# EAGLE design custom-arduino (EAGLE 9.6.1)
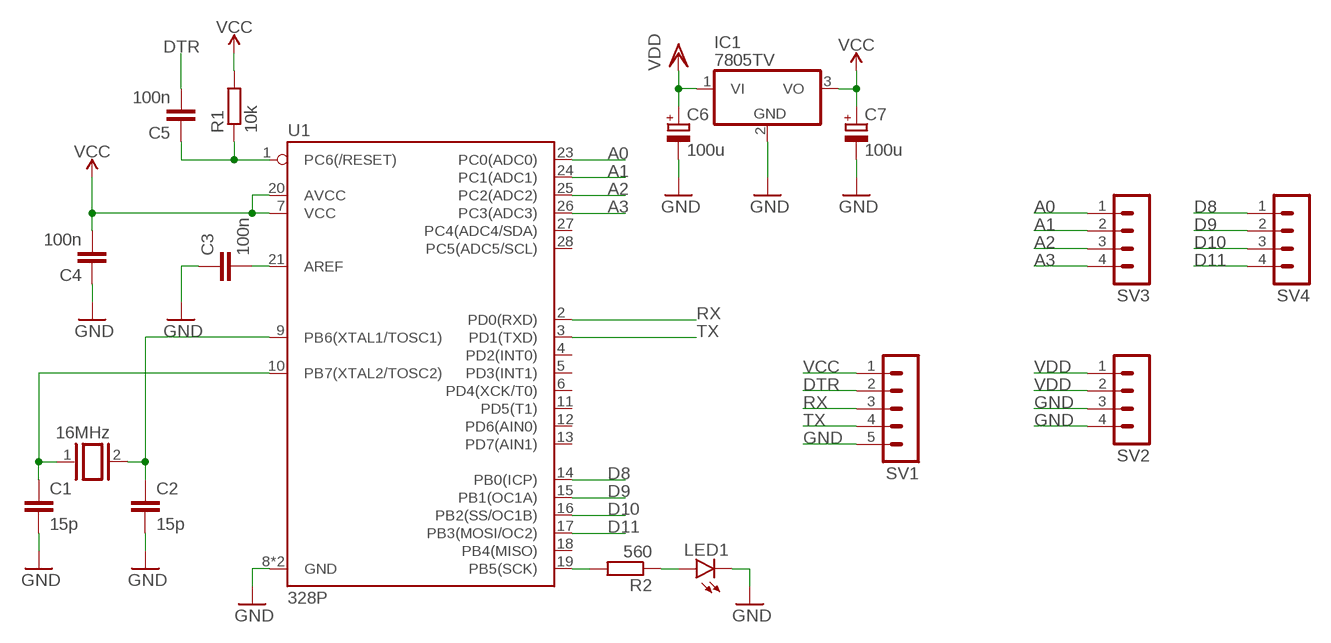
[diagram p0: schematic, sheet 1]

## Parts
C1  15p  C-EU025-024X044  [C025-024X044]
C2  15p  C-EU025-024X044  [C025-024X044]
C3  100n  C-EU025-024X044  [C025-024X044]
C4  100n  C-EU025-024X044  [C025-024X044]
C5  100n  C-EU025-024X044  [C025-024X044]
C6  100u  CPOL-EUE2.5-7  [E2,5-7]
C7  100u  CPOL-EUE2.5-7  [E2,5-7]
IC1  7805TV  [TO220V]
LED1  LED5MM  [LED5MM]
Q1  16MHz  XTAL/S  [QS]
R1  10k  R-EU_0207/10  [0207/10]
R2  560  R-EU_0207/10  [0207/10]
SV1  MA05-1  [MA05-1]
SV2  MA04-1  [MA04-1]
SV3  MA04-1  [MA04-1]
SV4  MA04-1  [MA04-1]
U1  328P  ATMEGA328P_PDIP  [DIP28]

## Nets
A0: SV3.1 U1.23(PC0(ADC0))
A1: SV3.2 U1.24(PC1(ADC1))
A2: SV3.3 U1.25(PC2(ADC2))
A3: SV3.4 U1.26(PC3(ADC3))
D8: SV4.1 U1.14(PB0(ICP))
D9: SV4.2 U1.15(PB1(OC1A))
D10: SV4.3 U1.16(PB2(SS/OC1B))
D11: SV4.4 U1.17(PB3(MOSI/OC2))
DTR: C5.2 SV1.2
GND: C1.2 C2.2 C3.1 C4.1 C6.- C7.- IC1.2(GND) LED1.K(C) SV1.5 SV2.3 SV2.4 U1.8(GND) U1.22(GND)
N$1: C3.2 U1.21(AREF)
N$2: C5.1 R1.1 U1.1(PC6(/RESET))
N$3: R2.2 U1.19(PB5(SCK))
N$4: LED1.A R2.1
N$7: C2.1 Q1.2 U1.9(PB6(XTAL1/TOSC1))
N$8: C1.1 Q1.1 U1.10(PB7(XTAL2/TOSC2))
RX: SV1.3 U1.2(PD0(RXD))
TX: SV1.4 U1.3(PD1(TXD))
VCC: C4.2 C7.+ IC1.3(VO) R1.2 SV1.1 U1.7(VCC) U1.20(AVCC)
VDD: C6.+ IC1.1(VI) SV2.1 SV2.2
Unconnected: U1.4(PD2(INT0)) U1.5(PD3(INT1)) U1.6(PD4(XCK/T0)) U1.11(PD5(T1)) U1.12(PD6(AIN0)) U1.13(PD7(AIN1)) U1.18(PB4(MISO)) U1.27(PC4(ADC4/SDA)) U1.28(PC5(ADC5/SCL))

## Library data of the parts
C1-C5 = rcl:C-EU: CAPACITOR, European symbol; SPICEPREFIX: C
C6 C7 = rcl:CPOL-EU: POLARIZED CAPACITOR, European symbol; SPICEPREFIX: C
IC1 = linear:78*: Positive VOLTAGE REGULATOR Source: http://cache.national.com/ds/LM/LM78L05.pdf http://www.fairchildsemi.com/ds/LM/LM7805.pdf
LED1 = led:LED: LED OSRAM: - CHIPLED LG R971, LG N971, LY N971, LG Q971, LY Q971, LO R971, LY R971 LH N974, LH R974 LS Q976, LO Q976, LY Q976 LO Q996 - Hyper CHIPLED LW Q18S LB Q993, LB Q99A, LB R99A - SideLED LS A670, LO A670, LY A670, LG A670, LP A670 LB A673, LV A673, LT A673, LW A673 LH A674 LY A675 LS A676, LA A676, LO A676, LY A676, LW A676 LS A679, LY A679, LG A679 - Hyper Micro SIDELED® LS Y876, LA Y876, LO Y876, LY Y876 LT Y87S - SmartLED LW L88C, LW L88S LB L89C, LB L89S, LG L890 LS L89K, LO L89K, LY L89K LS L896, LA L896, LO L896, LY L896 - TOPLED LS T670, LO T670, LY T670, LG T670, LP T670 LSG T670, LSP T670, LSY T670, LOP T670, LYG T670 LG T671, LOG T671, LSG T671 LB T673, LV T673, LT T673, LW T673 LH T674 LS T676, LA T676, LO T676, LY T676, LB T676, LH T676, LSB T676, LW T676 LB T67C, LV T67C, LT T67C, LS T67K, LO T67K, LY T67K, LW E67C LS E67B, LA E67B, LO E67B, LY E67B, LB E67C, LV E67C, LT E67C LW T67C LS T679, LY T679, LG T679 LS T770, LO T770, LY T770, LG T770, LP T770 LB T773, LV T773, LT T773, LW T773 LH T774 LS E675, LA E675, LY E675, LS T675 LS T776, LA T776, LO T776, LY T776, LB T776 LHGB T686 LT T68C, LB T68C - Hyper Mini TOPLED® LB M676 - Mini TOPLED Santana® LG M470 LS M47K, LO M47K, LY M47K Source: http://www.osram.convergy.de LUXEON: - LUMILED® LXK2-PW12-R00, LXK2-PW12-S00, LXK2-PW14-U00, LXK2-PW14-V00 LXK2-PM12-R00, LXK2-PM12-S00, LXK2-PM14-U00 LXK2-PE12-Q00, LXK2-PE12-R00, LXK2-PE12-S00, LXK2-PE14-T00, LXK2-PE14-U00 LXK2-PB12-K00, LXK2-PB12-L00, LXK2-PB12-M00, LXK2-PB14-N00, LXK2-PB14-P00, LXK2-PB14-Q00 LXK2-PR12-L00, LXK2-PR12-M00, LXK2-PR14-Q00, LXK2-PR14-R00 LXK2-PD12-Q00, LXK2-PD12-R00, LXK2-PD12-S00 LXK2-PH12-R00, LXK2-PH12-S00 LXK2-PL12-P00, LXK2-PL12-Q00, LXK2-PL12-R00 Source: www.luxeon.com KINGBRIGHT: KA-3528ASYC Source: www.kingbright.com
Q1 = special:XTAL/S: CRYSTAL
R1 R2 = rcl:R-EU_: RESISTOR, European symbol; SPICEPREFIX: R
SV1 = con-lstb:MA05-1: PIN HEADER; OC_FARNELL: unknown; OC_NEWARK: unknown
SV2-SV4 = con-lstb:MA04-1: PIN HEADER; OC_FARNELL: unknown; OC_NEWARK: unknown
U1 = SparkFun-IC-Microcontroller:ATMEGA328P_PDIP: Atmel 328P Through hole ATMEGA328P uC used in the Arduino 32kb flash, 1k EEPROM, 2k SRAM Datasheet <http://www.sparkfun.com/datasheets/Components/SMD/ATMega328.pdf> SparkFun Products Storefront component: AVR 28 Pin 20MHz 32K 6A/D - ATMega328P <https://www.sparkfun.com/products/9061> (COM-09061) SparkFun Simon Says - Through-Hole Soldering Kit <https://www.sparkfun.com/products/10547> (KIT-10547) SparkFun Learn to Solder - Simon Says <https://www.sparkfun.com/products/13708> (KIT-13708) SparkFun BigTime Watch Kit <https://www.sparkfun.com/products/11734> (KIT-11734) SparkFun ClockIt <https://www.sparkfun.com/products/10930> (KIT-10930) SparkFun Serial Enabled LCD Kit <https://www.sparkfun.com/products/10097> (LCD-10097) SparkFun Simon Tilts - Through Hole Soldering Kit <https://www.sparkfun.com/products/12634> (KIT-12634) SparkFun Frequency Counter Kit <https://www.sparkfun.com/products/10140> (KIT-10140) FabFM Radio Kit <https://www.sparkfun.com/products/11043> (KIT-11043) SparkFun Binary Blaster Kit <https://www.sparkfun.com/products/12037> (KIT-12037) SparkFun Metro-Gnome <https://www.sparkfun.com/products/9236> (KIT-09236) ATmega328 with Arduino Optiboot (Uno) <https://www.sparkfun.com/products/10524> (DEV-10524); PROD_ID: IC-09136

## Board
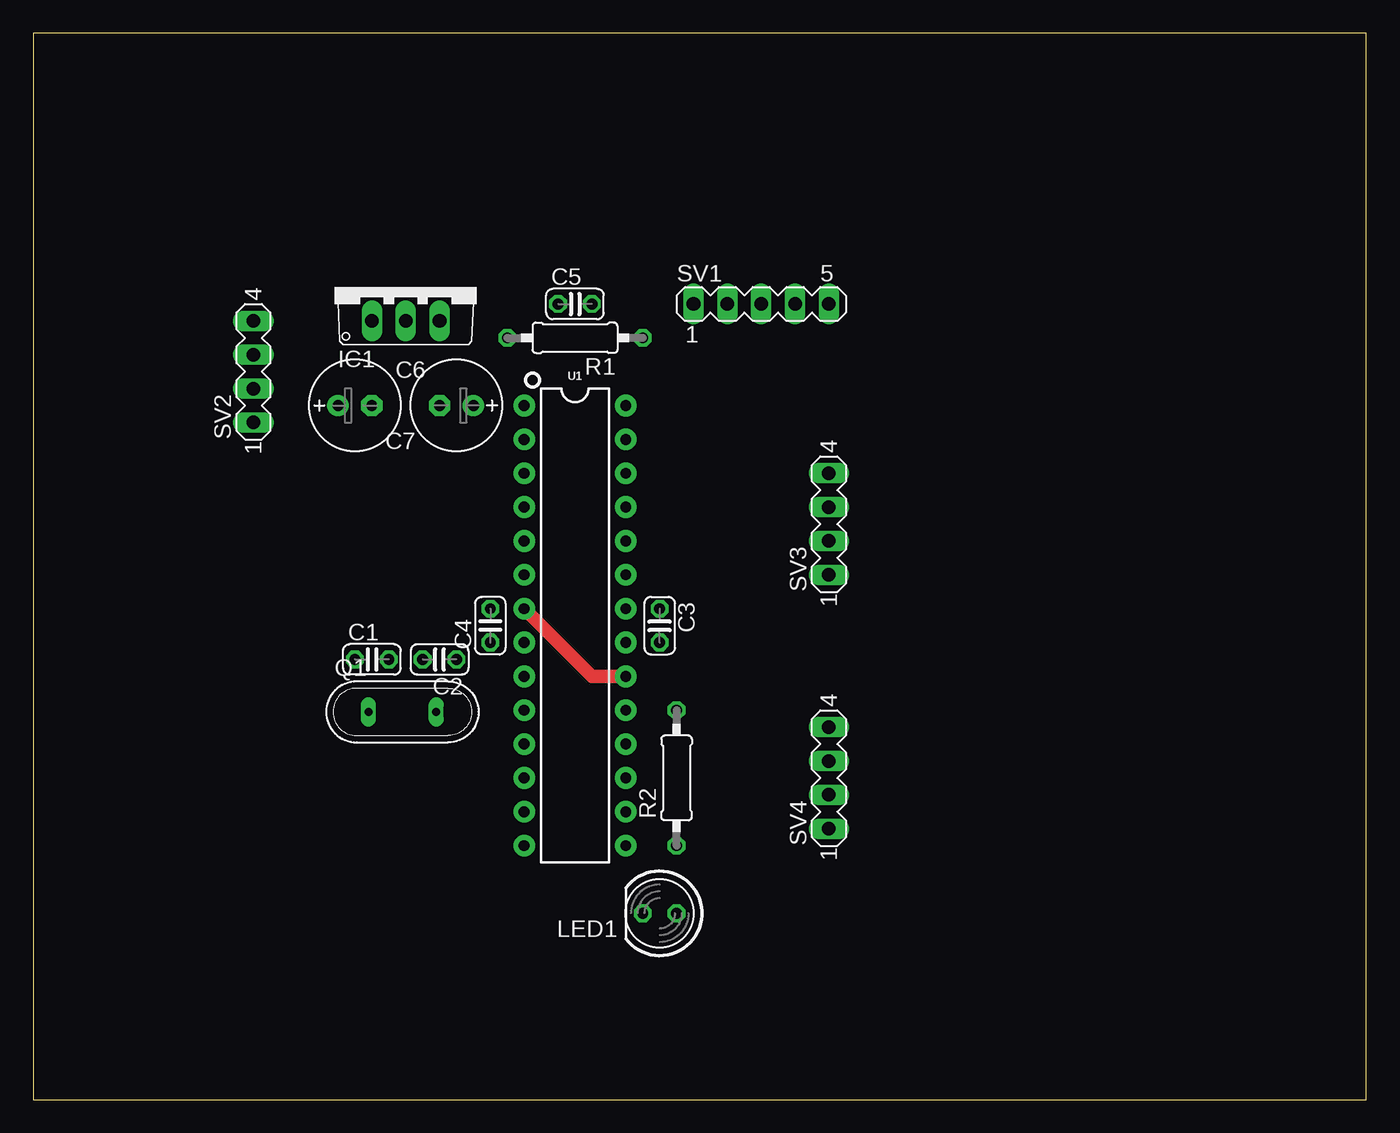
[diagram p1: board, top side]
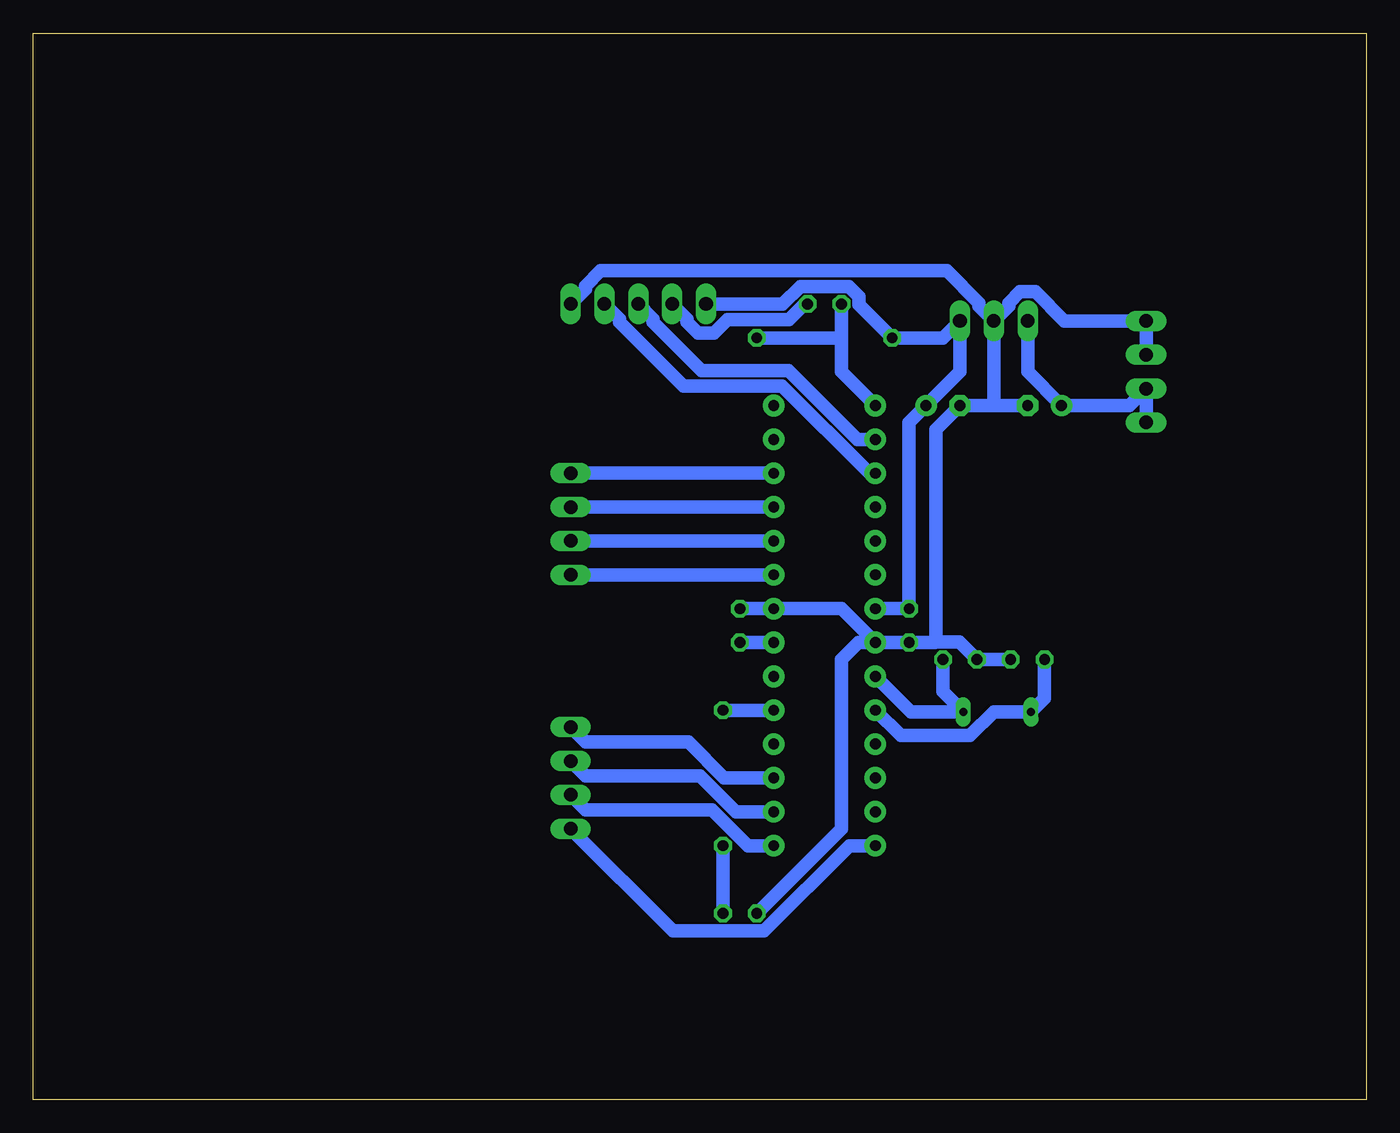
[diagram p2: board, bottom side, seen from below]

Size 100 x 80 mm. Coordinates in mm from the lower left corner, seen from the top.
Outline: 0,0 100,0 100,80 0,80 0,0
Copper layers (1*16): Top 0.035mm / dielectric 1.5mm / Bottom 0.035mm
Design rules "default": minimum track width 6mil, minimum drill 0.35mm, track to track 6mil, track to pad 6mil, pad to pad 6mil, via to via 6mil, smd to smd 6mil, copper to edge 40mil, drill to drill 6mil, minimum pad ring 10mil, minimum via ring 8mil, stop-mask expansion 4mil, vias tented up to drill 0mil, thermal gap 10mil

### Footprints (pad centres in the part's own frame; a part is rotated, then mirrored left to right if it is on the bottom)
C025-024X044 = drill 0.813 octagon: 1 -1.27,0; 2 1.27,0
E2,5-7 = drill 0.813 pad 1.6: + -1.27,0 | drill 0.813 pad 1.6 octagon: - 1.27,0
TO220V = drill 1.016 long: 1 -2.54,-2.54; 2 0,-2.54; 3 2.54,-2.54
LED5MM = drill 0.813 octagon: A -1.27,0; K 1.27,0
QS = drill 0.61 long: 1 -2.54,0; 2 2.54,0
0207/10 = drill 0.813 octagon: 1 -5.08,0; 2 5.08,0
MA05-1 = drill 1.016 long: 1 -5.08,0; 2 -2.54,0; 3 0,0; 4 2.54,0; 5 5.08,0
MA04-1 = drill 1.016 long: 1 -3.81,0; 2 -1.27,0; 3 1.27,0; 4 3.81,0
DIP28 = drill 0.813 pad 1.626: 1 -16.51,-3.81; 2 -13.97,-3.81; 3 -11.43,-3.81; 4 -8.89,-3.81; 5 -6.35,-3.81; 6 -3.81,-3.81; 7 -1.27,-3.81; 8 1.27,-3.81; 9 3.81,-3.81; 10 6.35,-3.81; 11 8.89,-3.81; 12 11.43,-3.81; 13 13.97,-3.81; 14 16.51,-3.81; 15 16.51,3.81; 16 13.97,3.81; 17 11.43,3.81; 18 8.89,3.81; 19 6.35,3.81; 20 3.81,3.81; 21 1.27,3.81; 22 -1.27,3.81; 23 -3.81,3.81; 24 -6.35,3.81; 25 -8.89,3.81; 26 -11.43,3.81; 27 -13.97,3.81; 28 -16.51,3.81

### Placement (x,y rotation side)
C1  25.4,33.02 0 top
C2  30.48,33.02 180 top
C3  46.99,35.56 270 top
C4  34.29,35.56 90 top
C5  40.64,59.69 0 top
C6  24.13,52.07 0 top
C7  31.75,52.07 180 top
IC1  27.94,60.96 0 top
LED1  46.99,13.97 180 top
Q1  27.69,29.08 0 top
R1  40.64,57.15 180 top
R2  48.26,24.13 90 top
SV1  54.61,59.69 0 top
SV2  16.51,54.61 90 top
SV3  59.69,43.18 90 top
SV4  59.69,24.13 90 top
U1  40.64,35.56 270 top

### Tracks (layer width: path | path; a pad name or v marks a point on that pad's centre or on a via)
A0
  Bottom 1.016: SV3.1 U1.23
A1
  Bottom 1.016: SV3.2 U1.24
A2
  Bottom 1.016: SV3.3 U1.25
A3
  Bottom 1.016: SV3.4 U1.26
D8
  Bottom 1.016: U1.14 38.77,19.05 45.17,12.65 52.02,12.65 SV4.1
D9
  Bottom 1.016: SV4.2 58.57,21.74 49.09,21.74 46.39,19.05 U1.15
D10
  Bottom 1.016: SV4.3 58.57,24.28 49.97,24.28 47.28,21.59 U1.16
D11
  Bottom 1.016: SV4.4 58.57,26.82 50.86,26.82 48.17,24.13 U1.17
DTR
  Bottom 1.016: C5.2 42.13,59.69 43.29,58.52 47.92,58.52 48.94,57.51 50.12,57.51 50.95,58.34 50.95,58.57 SV1.2
GND
  Bottom 1.016: C1.2 C2.2 30.53,34.34 32.3,34.34 | U1.8 39.37,36.83 U1.22 C3.1 | LED1.K 39.37,20.32 39.37,33.02 38.1,34.29 U1.8 | U1.8 C4.1 32.35,34.29 32.3,34.34 | C6.- 27.94,52.07 | 27.94,52.07 C7.- 32.3,50.25 32.3,34.34 | IC1.2 27.94,52.07 | IC1.2 29.06,59.54 29.06,59.77 31.47,62.18 57.43,62.18 58.57,61.04 58.57,60.81 SV1.5 | IC1.2 26.82,59.54 26.82,59.77 25.99,60.6 24.81,60.6 22.63,58.42 SV2.4 SV2.3
N$1
  Bottom 1.016: U1.21 C3.2
N$2
  Bottom 1.016: U1.1 39.37,54.61 39.37,57.15 | 39.37,57.15 C5.1 | R1.1 39.37,57.15
N$3
  Bottom 1.016: U1.19 R2.2
N$4
  Bottom 1.016: R2.1 LED1.A
N$7
  Bottom 1.016: U1.9 34.16,29.08 Q1.2 31.75,30.61 C2.1
N$8
  Bottom 1.016: U1.10 34.92,27.3 29.72,27.3 27.94,29.08 Q1.1 24.13,30.1 C1.1
RX
  Bottom 1.016: SV1.3 53.49,58.57 53.49,58.34 49.87,54.71 43.36,54.71 38.17,49.53 U1.2
TX
  Bottom 1.016: SV1.4 56.03,58.57 56.03,58.34 51.24,53.54 43.84,53.54 37.29,46.99 U1.3
VCC
  Top 1.016: U1.20 41.91,31.75 U1.7
  Bottom 1.016: U1.7 C4.2 34.29,50.8 C7.+ 30.48,54.61 IC1.3 31.75,57.15 R1.2 38.05,59.64 38.05,60.24 38.82,61.01 42.46,61.01 43.78,59.69 SV1.1
VDD
  Bottom 1.016: IC1.1 25.4,54.61 C6.+ 17.78,52.07 SV2.2 SV2.1